# EAGLE schematic tqfp-32 (EAGLE 6.4)
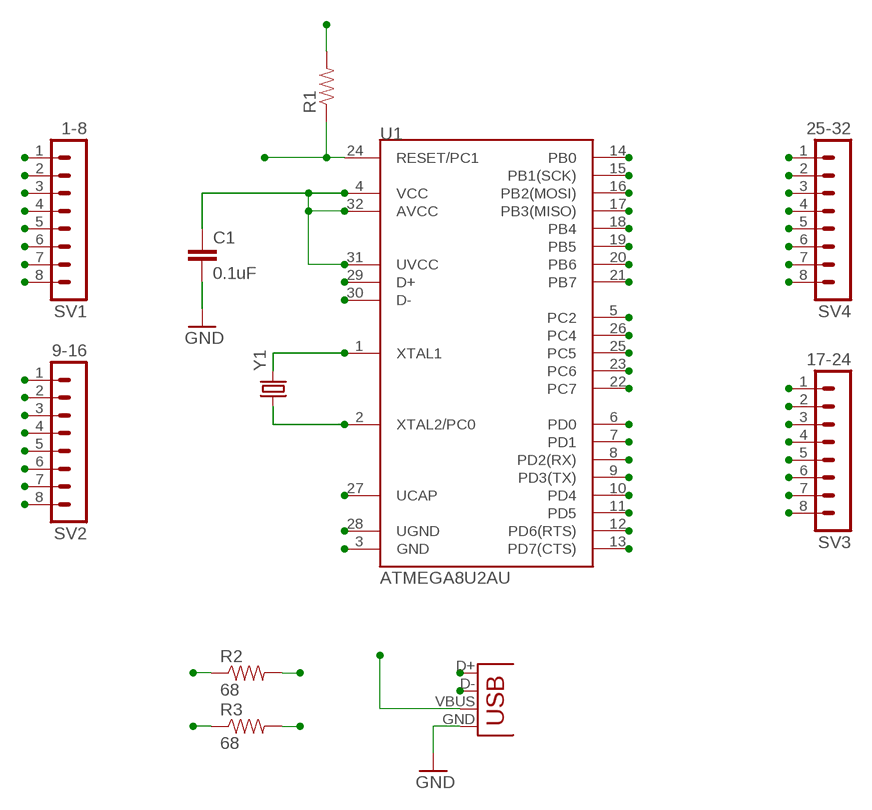
[diagram p0: schematic, sheet 1]

## Parts
C1  0.1uF  CAP0603-CAP  [0603-CAP]
R1  RESISTOR0603-RES  [0603-RES]
R2  68  RESISTOR0603-RES  [0603-RES]
R3  68  RESISTOR0603-RES  [0603-RES]
SV1  1-8  MA08-1  [MA08-1]
SV2  9-16  MA08-1  [MA08-1]
SV3  17-24  MA08-1  [MA08-1]
SV4  25-32  MA08-1  [MA08-1]
U1  ATMEGA8U2AU  [TQFP32-08]
X1  USBSMD  [USB-MINIB]
Y1  CRYSTAL5X3  [CRYSTAL-SMD-5X3]

## Nets
1: U1.1(XTAL1) Y1.3
2: U1.2(XTAL2/PC0) Y1.1
3: SV1.3 U1.3(GND)
3V3: R1.2 SV1.4
5: SV1.5 U1.5(PC2)
5V: C1.1 SV1.1 U1.4(VCC) U1.31(UVCC) U1.32(AVCC) X1.VBUS
6: SV1.6 U1.6(PD0)
7: SV1.7 U1.7(PD1)
8: SV1.8 U1.8(PD2(RX))
9: SV2.1 U1.9(PD3(TX))
10: SV2.2 U1.10(PD4)
11: SV2.3 U1.11(PD5)
12: SV2.4 U1.12(PD6(RTS))
13: SV2.5 U1.13(PD7(CTS))
14: SV2.6 U1.14(PB0)
18: SV3.2 U1.18(PB4)
19: SV3.3 U1.19(PB5)
20: SV3.4 U1.20(PB6)
21: SV3.5 U1.21(PB7)
22: SV3.6 U1.22(PC7)
23: SV3.7 U1.23(PC6)
25: SV4.1 U1.25(PC5)
26: SV4.2 U1.26(PC4)
27: SV4.3 U1.27(UCAP)
28: SV4.4 U1.28(UGND)
29: R2.1 SV4.5 U1.29(D+)
30: R3.1 SV4.6 U1.30(D-)
31: SV4.7
32: SV4.8
BUS_D+: R2.2 X1.D+
BUS_D-: R3.2 X1.D-
GND: C1.2 X1.GND
MISO: SV3.1 U1.17(PB3(MISO))
MOSI: SV2.8 U1.16(PB2(MOSI))
N$2: SV1.2
RST: R1.1 SV3.8 U1.24(RESET/PC1)
SCK: SV2.7 U1.15(PB1(SCK))

## Library data of the parts
C1 = SparkFun:CAP: Capacitor Standard 0603 ceramic capacitor, and 0.1" leaded capacitor.
R1 = SparkFun:RESISTOR: Resistor Basic schematic elements and footprints for 0603, 1206, and PTH resistors.
R2 R3 = SparkFun-Passives:RESISTOR: Resistor Basic schematic elements and footprints for 0603, 1206, and PTH resistors.
SV1-SV4 = con-lstb:MA08-1: PIN HEADER; OC_FARNELL: unknown; OC_NEWARK: unknown
U1 = SparkFun:ATMEGA8U2: Atmel 8-bit Microcontroller with 8/16/32K Bystes of ISP Flash and USB Controller. ATmega8U2, ATmega16U2, and ATmega32U2
X1 = SparkFun-Connectors:USB: USB Connectors USB-B-PTH is fully proven SKU : PRT-00139 USB-miniB is fully proven SKU : PRT-00587 USB-A-PCB is untested. USB-A-H is throughly reviewed, but untested. Spark Fun Electronics SKU : PRT-00437 USB-B-SMT is throughly reviewed, but untested. Needs silkscreen touching up. USB-A-S has not been used/tested USB-MB-H has not been used/tested
Y1 = SparkFun:CRYSTAL: Crystals Various standard crystals. Proven footprints. Spark Fun Electronics SKU : COM-00534